# Altium schematic sheet OK1050-C_V1.2_Audio.SchDoc
size A3; Revision: 1.2; SheetNumber: 6; SheetTotal: 7
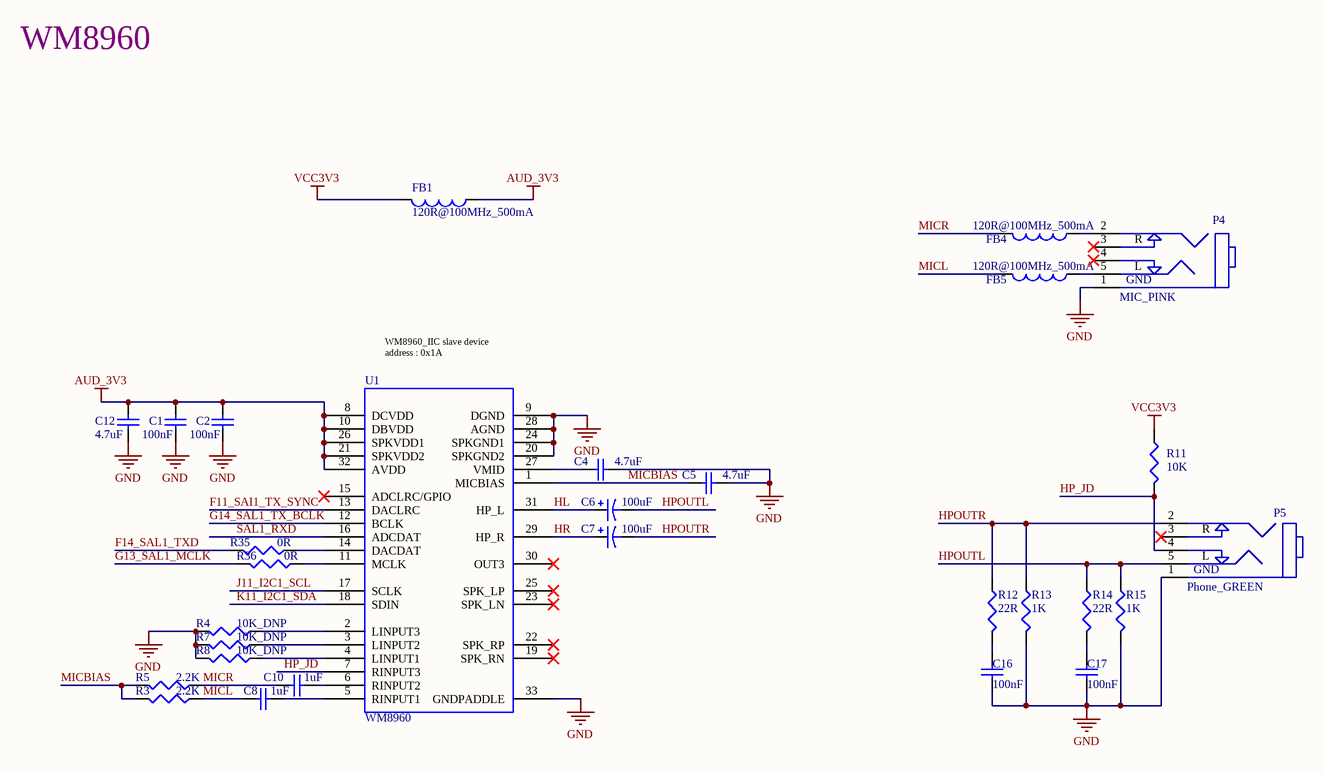
[diagram p0: OK1050-C_V1.2_Audio.SchDoc]

## Parts
C1  100nF  [0603C+]
C2  100nF  [0603C+]
C4  4.7uF  [0603C+]
C5  4.7uF  [0603C+]
C6  100uF  [TC3528B]
C7  100uF  [TC3528B]
C8  1uF  [0603C+]
C10  1uF  [0603C+]
C12  4.7uF  [0603C+]
C16  100nF  [0603C+]
C17  100nF  [0603C+]
FB1  120R@100MHz_500mA  [0603R+]
FB4  120R@100MHz_500mA  [0603R+]
FB5  120R@100MHz_500mA  [0603R+]
P4  MIC_PINK  [PHONEJACK SW]
P5  Phone_GREEN  [PHONEJACK SW]
R3  2.2K  [0603R+]
R4  10K_DNP  [0603R+]
R5  2.2K  [0603R+]
R7  10K_DNP  [0603R+]
R8  10K_DNP  [0603R+]
R11  10K  [0603R+]
R12  22R  [0603R+]
R13  1K  [0603R+]
R14  22R  [0603R+]
R15  1K  [0603R+]
R35  0R  [0603R+]
R36  0R  [0603R+]
U1  WM8960  [WM8960]

## Nets
AUD_3V3: C1.2 C2.2 C12.2 FB1.1 U1.8(DCVDD) U1.10(DBVDD) U1.21(SPKVDD2) U1.26(SPKVDD1) U1.32(AVDD)
GND: C1.1 C2.1 C4.1 C5.1 C12.1 C16.2 C17.2 P4.1(GND) P5.1(GND) R4.2 R7.2 R8.2 R13.2 R15.2 U1.9(DGND) U1.20(SPKGND2) U1.24(SPKGND1) U1.28(AGND) U1.33(GNDPADDLE)
VCC3V3: FB1.2 R11.1
F11_SAI1_TX_SYNC: U1.13(DACLRC)
F14_SAL1_TXD: R35.2
G13_SAL1_MCLK: R36.2
G14_SAL1_TX_BCLK: U1.12(BCLK)
HL: C6.1 U1.31(HP_L)
HP_JD: P5.4 R11.2 U1.7(RINPUT3)
HPOUTL: C6.2 P5.5 R14.1 R15.1
HPOUTR: C7.2 P5.2 R12.1 R13.1
HR: C7.1 U1.29(HP_R)
J11_I2C1_SCL: U1.17(SCLK)
K11_I2C1_SDA: U1.18(SDIN)
MICBIAS: C5.2 R3.2 R5.2 U1.1(MICBIAS)
MICL: C8.2 FB5.2 R3.1
MICR: C10.2 FB4.2 R5.1
SAL1_RXD: U1.16(ADCDAT)
NetC4_2: C4.2 U1.27(VMID)
NetC8_1: C8.1 U1.5(RINPUT1)
NetC10_1: C10.1 U1.6(RINPUT2)
NetC16_1: C16.1 R12.2
NetC17_1: C17.1 R14.2
NetFB4_1: FB4.1 P4.2
NetFB5_1: FB5.1 P4.5
NetR4_1: R4.1 U1.2(LINPUT3)
NetR7_1: R7.1 U1.3(LINPUT2)
NetR8_1: R8.1 U1.4(LINPUT1)
NetR35_1: R35.1 U1.14(DACDAT)
NetR36_1: R36.1 U1.11(MCLK)

Not connected (* = marked no-connect by the designer): P4 3* 4*; P5 3*; U1 15(ADCLRC/GPIO)* 19(SPK_RN)* 22(SPK_RP)* 23(SPK_LN)* 25(SPK_LP)* 30(OUT3)*

## Notes on the sheet
- WM8960
- WM8960_IIC slave device address : 0x1A
- 设计
- 审核
- 工艺
- 图纸名称
- 孙木
- 批准
- 标准化
- 日期
- 版本
- 页码
- 第
- 页
- 共
- (in symbol Phonejack Stereo SW) R; L

## Library data of the parts
C1 C2 C4 C5 C8 C10 C12 C16 C17 = Cap: Capacitor; Published: 8-Jun-2000; LatestRevisionDate: 17-Jul-2002; LatestRevisionNote: Re-released for DXP Platform.; PackageReference: RAD-0.3; Publisher: Altium Limited; PackageDescription: Radial Cap, Thru-Hole; 2 Leads; 0.3 in Pin Spacing
  C1 C2 C16 C17: Value: 100nF
  C4 C5 C12: Value: 4.7uF
  C8 C10: Value: 1uF
C6 C7 = Cap Pol1: Polarized Capacitor (Radial); Published: 8-Jun-2000; LatestRevisionDate: 17-Jul-2002; LatestRevisionNote: Re-released for DXP Platform.; PackageReference: RB7.6-15; Publisher: Altium Limited; PackageDescription: Polarized Capacitor (Radial); 2 Leads; Value: 100uF
FB1 FB4 FB5 = Inductor: Code_IEC: 1005; Published: 8-Jun-2000; LatestRevisionDate: 29-May-2009; LatestRevisionNote: IPC-7351 Footprint Added.; PackageReference: 0402-A; Publisher: Altium Limited; PackageDescription: Chip Inductor; Code_JEITA: 0402; Value: 120R@100MHz_500mA
P4 P5 = Phonejack Stereo SW: VALUE: HEDAJACK
R3-R5 R7 R8 R11-R15 R35 R36 = Res3: Resistor; Published: 8-Jun-2000; LatestRevisionDate: 29-May-2009; LatestRevisionNote: IPC-7351 Footprint Added.; PackageReference: J1-0603; Publisher: Altium Limited; PackageDescription: Chip Resistor
  R3 R5: Value: 2.2K
  R4 R7 R8: Value: 10K_DNP
  R11: Value: 10K
  R12 R14: Value: 22R
  R13 R15: Value: 1K
  R35 R36: Value: 0R